# Altium schematic sheet Tag201_GangProgrammerRev2.SchDoc
size B; Date: 2/10/2009; ApprovedBy: Touraj; DrawnBy: Juan A. Nadal; Engineer: Touraj; Organization: ActiveWave; Address1: 902 Clint Moore Rd., Suite 118; Address2: Boca Raton; Address3: FL, 33487; Address4: 561-999-9422; DocumentNumber: 3; Revision: 21; SheetNumber: 3; SheetTotal: 4; PageSetup: Record=PageOptions|CenterHorizontal=True|CenterVertical=True|PrintScale=0.70|XCorrection=1.00|YCorrection=1.00|PrintKind=0|BorderSize=5000000|LeftOffset=0|BottomOffset=0|Orientation=2|PaperLength=1000|PaperWidth=1000|Scale=100|PaperSource=7|PrintQuality=-4|MediaType=1|DitherType=10|PaperKind=Letter|PrintScaleMode=1; Project: Tag105
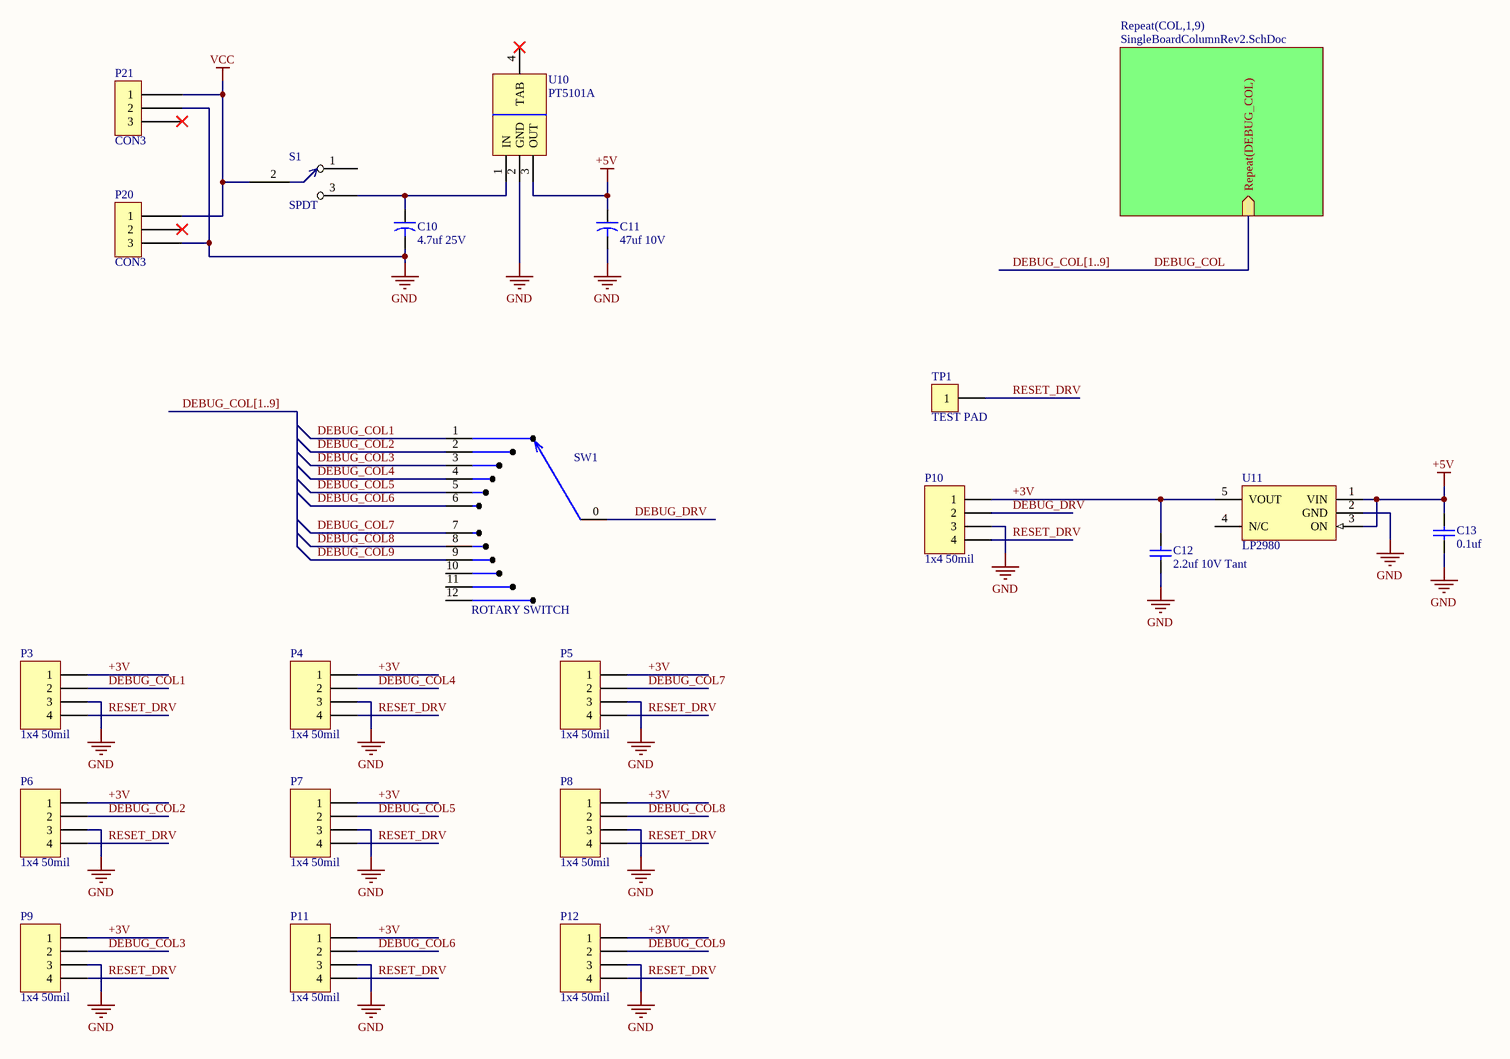
[diagram p0: Tag201_GangProgrammerRev2.SchDoc]

## Parts
C10  4.7uf 25V  [CAP C CASE_041412]
C11  47uf 10V  [CAP D CASE_030205]
C12  2.2uf 10V Tant  [CAP A CASE_030205]
C13  0.1uf  [0603_072205]
P3  1x4 50mil  [1X4 HEADER_50mil_071411]
P4  1x4 50mil  [1X4 HEADER_50mil_071411]
P5  1x4 50mil  [1X4 HEADER_50mil_071411]
P6  1x4 50mil  [1X4 HEADER_50mil_071411]
P7  1x4 50mil  [1X4 HEADER_50mil_071411]
P8  1x4 50mil  [1X4 HEADER_50mil_071411]
P9  1x4 50mil  [1X4 HEADER_50mil_071411]
P10  1x4 50mil  [1X4 HEADER_50mil_071411]
P11  1x4 50mil  [1X4 HEADER_50mil_071411]
P12  1x4 50mil  [1X4 HEADER_50mil_071411]
P20  CON3  [POWER JACK_SMALLHOLE_022110]
P21  CON3  [Power Jack_SMT_071312]
S1  SPDT  [CnK_TseriesSPDT_Toggle_040512]
SW1  ROTARY SWITCH  [SWITCH_ROTARY_1P12T_101912]
TP1  TEST PAD  [TestPoint52x32]
U10  PT5101A  [TI_PowerTrendsPT_061812]
U11  LP2980  [SOT25_030205]

## Sub-sheets
Repeat(COL,1,9) = SingleBoardColumnRev2.SchDoc: Repeat(DEBUG_COL) (in)

## Nets
+5V: C11.1 C13.1 U10.3(OUT) U11.1(VIN) U11.3(ON)
GND: C10.2 C11.2 C12.2 C13.2 P3.3 P4.3 P5.3 P6.3 P7.3 P8.3 P9.3 P10.3 P11.3 P12.3 P20.3 P21.2 U10.2(GND) U11.2(GND)
VCC: P20.1 P21.1 S1.2
+3V: C12.1 P3.1 P4.1 P5.1 P6.1 P7.1 P8.1 P9.1 P10.1 P11.1 P12.1 U11.5(VOUT)
DEBUG_COL: sheet Repeat(COL,1,9)/Repeat(DEBUG_COL)
DEBUG_COL1: P3.2 SW1.1
DEBUG_COL2: P6.2 SW1.2
DEBUG_COL3: P9.2 SW1.3
DEBUG_COL4: P4.2 SW1.4
DEBUG_COL5: P7.2 SW1.5
DEBUG_COL6: P11.2 SW1.6
DEBUG_COL7: P5.2 SW1.7
DEBUG_COL8: P8.2 SW1.8
DEBUG_COL9: P12.2 SW1.9
DEBUG_DRV: P10.2 SW1.0
RESET_DRV: P3.4 P4.4 P5.4 P6.4 P7.4 P8.4 P9.4 P10.4 P11.4 P12.4 TP1.1
NetC10_1: C10.1 S1.3 U10.1(IN)

Not connected (* = marked no-connect by the designer): P20 2*; P21 3*; S1 1; SW1 10 11 12; U10 4(TAB)*; U11 4(N/C)

## Buses and harness runs
bus DEBUG_COL[1..9]

## Notes on the sheet
- APPROVALS
- DATE
- Title:
- Drawn:
- Checked:
- Release:
- Date:
- Size:
- Sheet Name:
- B
- Number:
- Time:
- Revision:
- Sheet
- of
- File:

## Library data of the parts
C10 = Cap2: Capacitor; PARTNO: T491A475M025AT; MAN: Kemet; VALUE: 4.7uf 25V; DK: 399-4630-1-ND
C11 = Cap2: Capacitor; PARTNO: TAJC476K010RNJ; MAN: AVX; VALUE: 47uf 10V; DK: 478-3910-1-ND
C12 = Cap: Capacitor; PARTNO: F931A225MAA; MAN: Nichicon; VALUE: 2.2uf 10V Tant; DK: 493-2356-1-ND
C13 = Cap: Capacitor; PARTNO: C0603C104Z3VACTU; MAN: Kemet; VALUE: 0.1uf; DK: 399-1100-2-ND
P3-P12 = Header 4: Header, 4-Pin; VALUE: 1x4 50mil; DK: 1x4 Header 0.5mil
P20 = CON3: PARTNO: PJ-102A; VALUE: POWER JACK; MAN: CUI; DK: CP-102A-ND
P21 = CON3: PARTNO: PJ-002A-SMT; VALUE: POWER JACK; MAN: CUI; DK: 002APJTR-ND
S1 = SWITCH SPST: PARTNO: T102SHCQE; MAN: C&K; VALUE: SPDT; DK: CKN10151-ND
SW1 = SwitchRotary1P12T: MFG_PN: 51DP30-01-1-AJN; MFG: Grayhill; VALUE: ROTARY SWITCH; SUPPLIER_PN: GH7278-ND; SUPPLIER: DigiKey
TP1 = CON1: Connector; VALUE: TEST PAD; DK: N/A; MAN: N/A; PARTNO: N/A
U10 = LM340T: MAN: PowerTrends; VALUE: PT5101A; DK: PT5101A-ND; PARTNO: PT5101A
U11 = LP2985: PARTNO: LP2980AIM5-3.3/NOPB; MAN: TI / National; VALUE: LP2980; DK: LP2980AIM5-3.3CT-ND